# Altium project OT.PrjPcb (part 1 of 2)
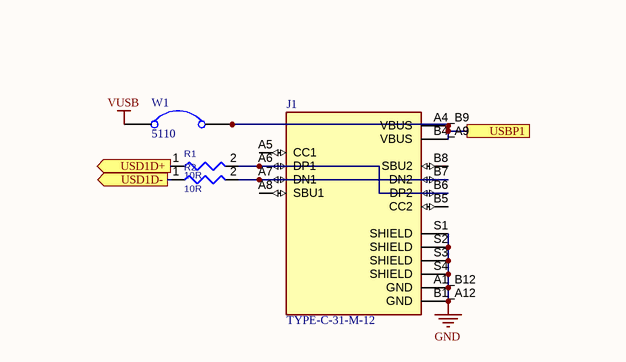
[diagram p0: Sheet_1.SchDoc, top left]
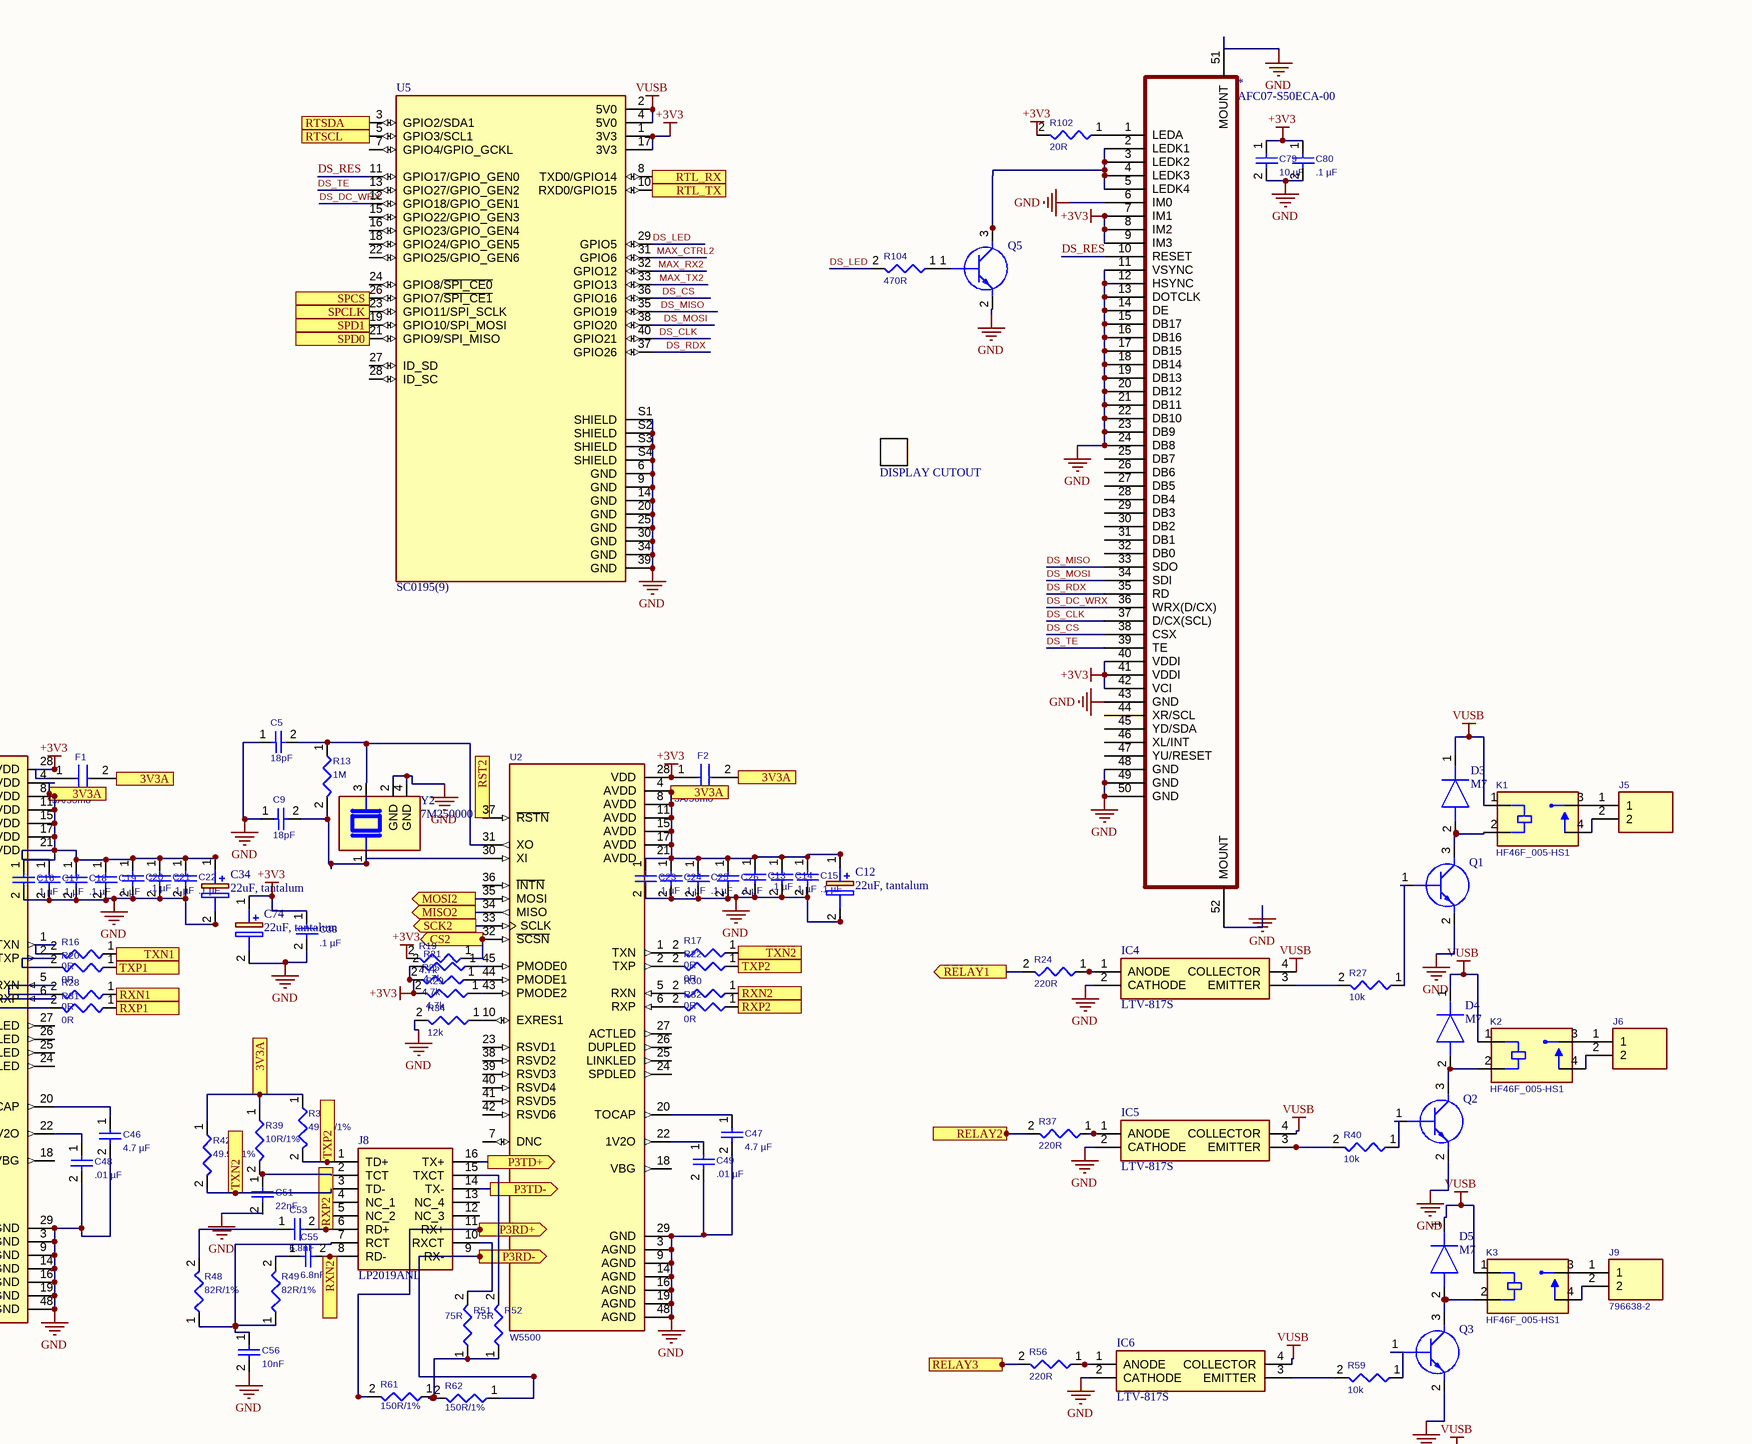
[diagram p1: Sheet_1.SchDoc, top right]
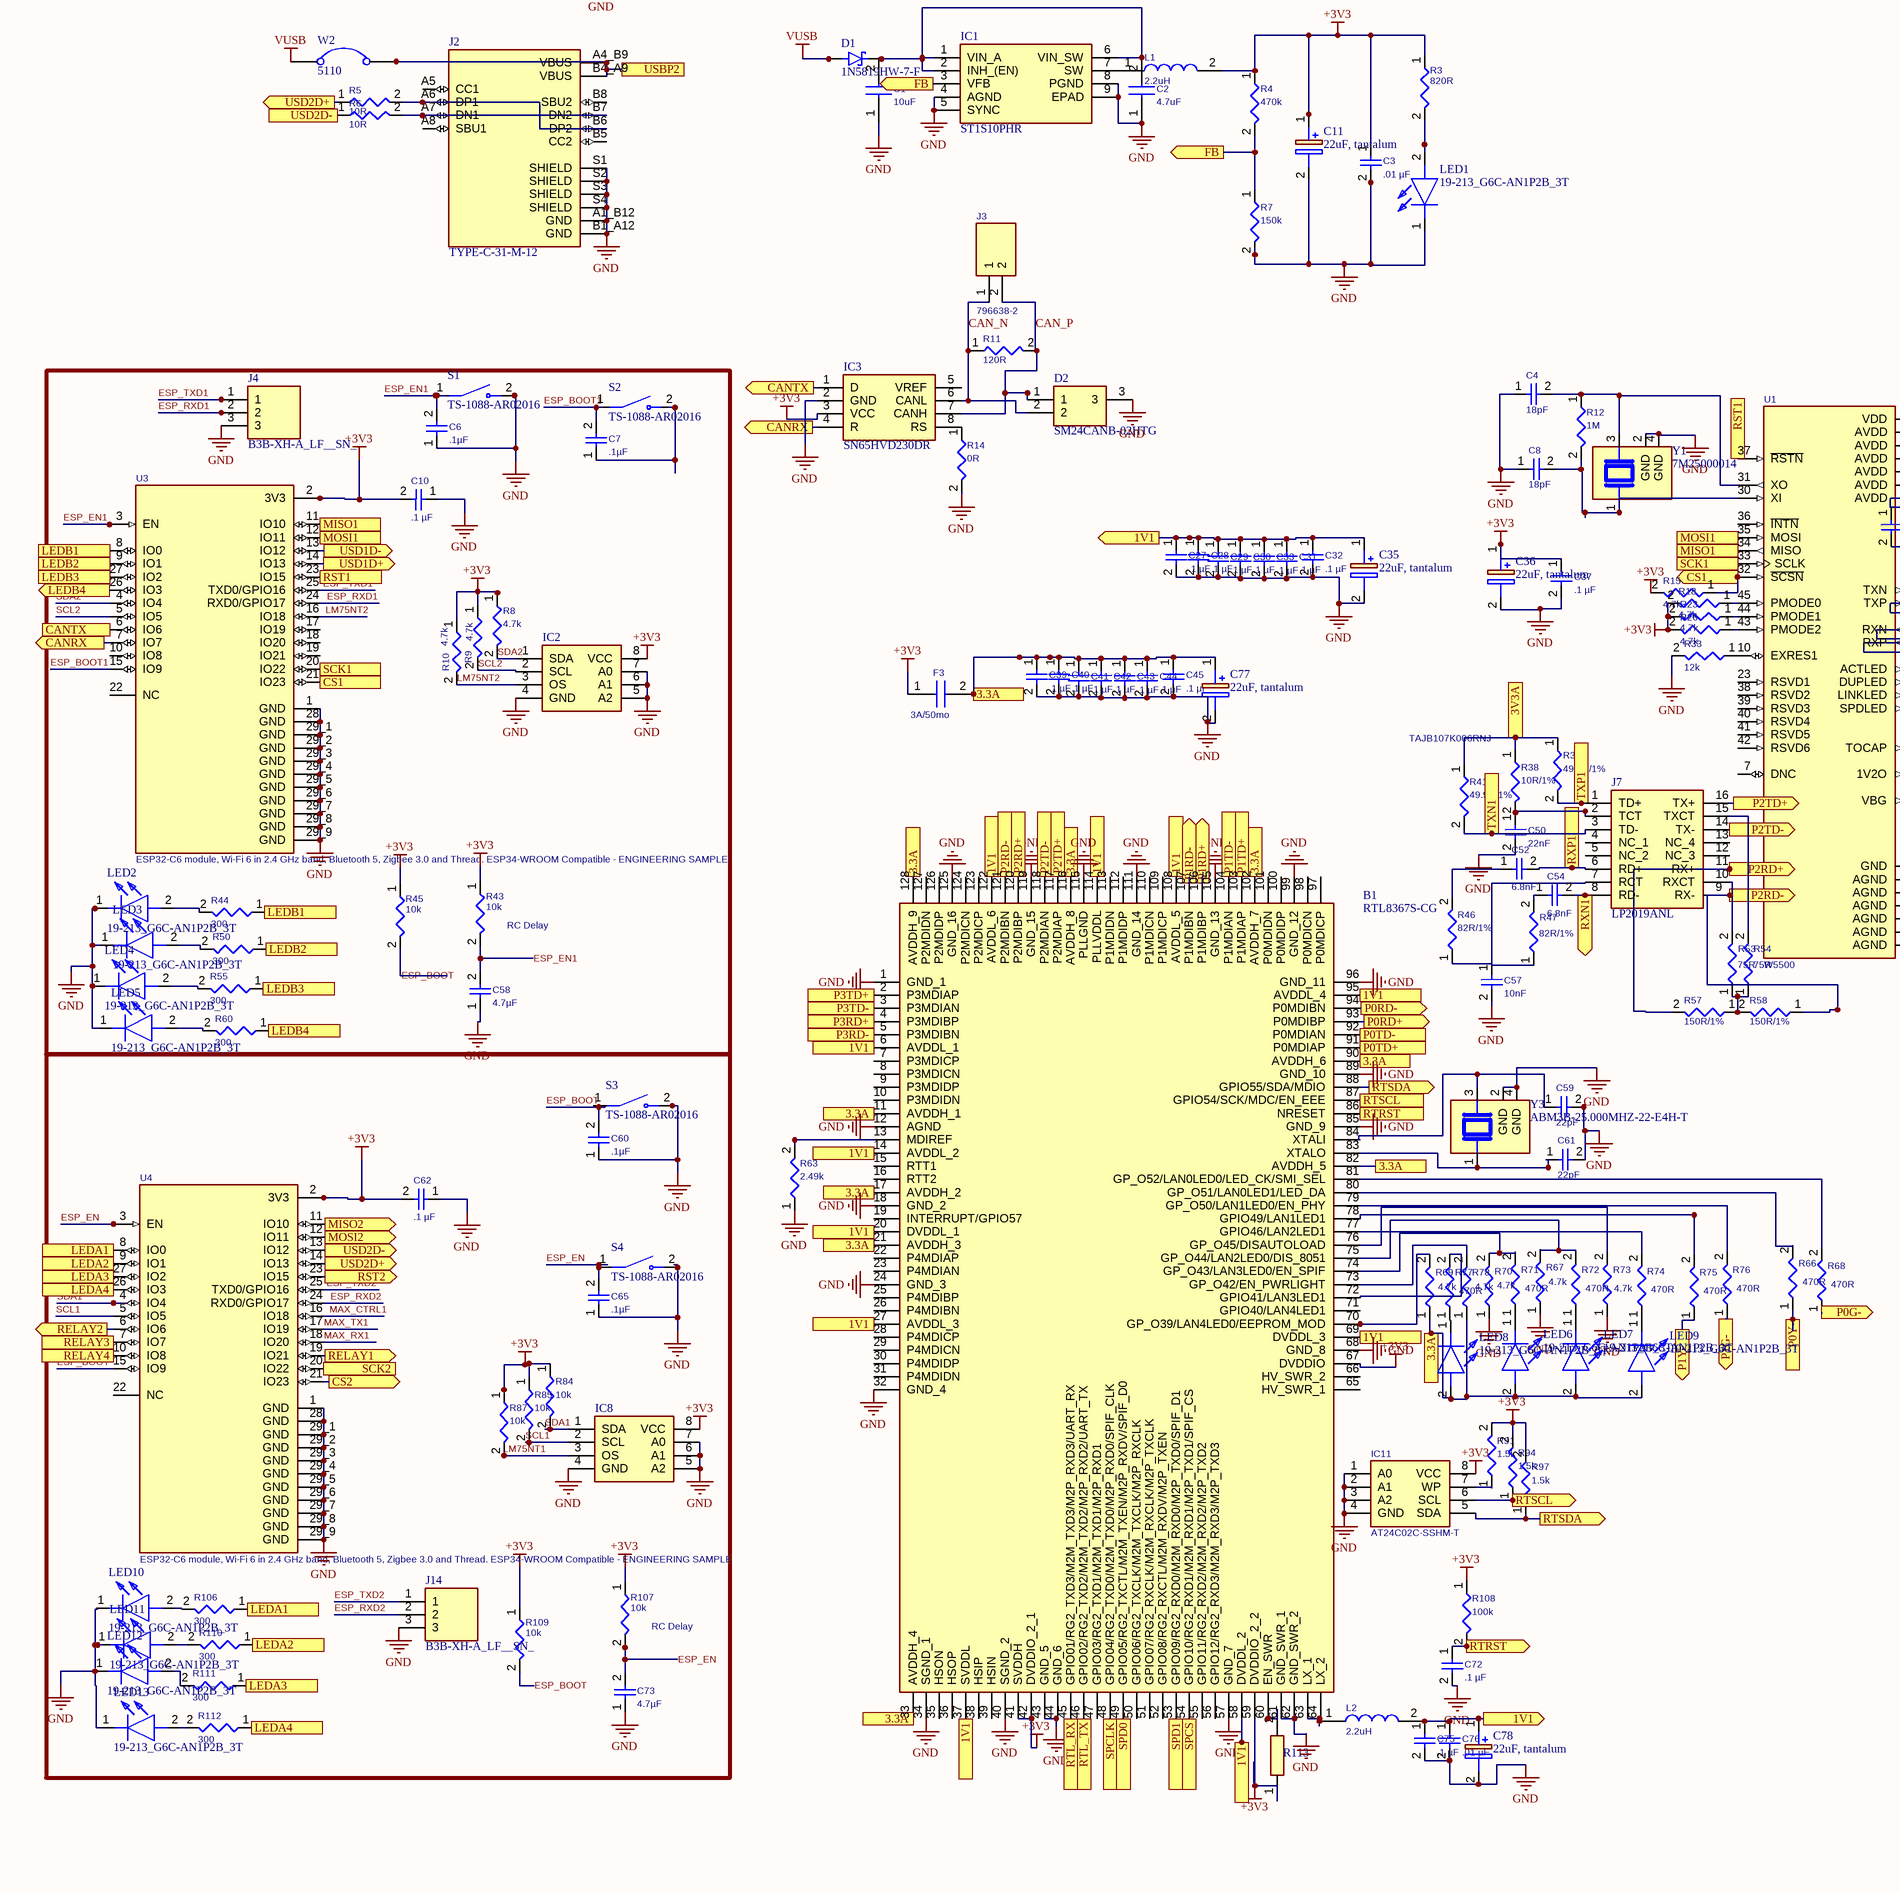
[diagram p2: Sheet_1.SchDoc, bottom left]
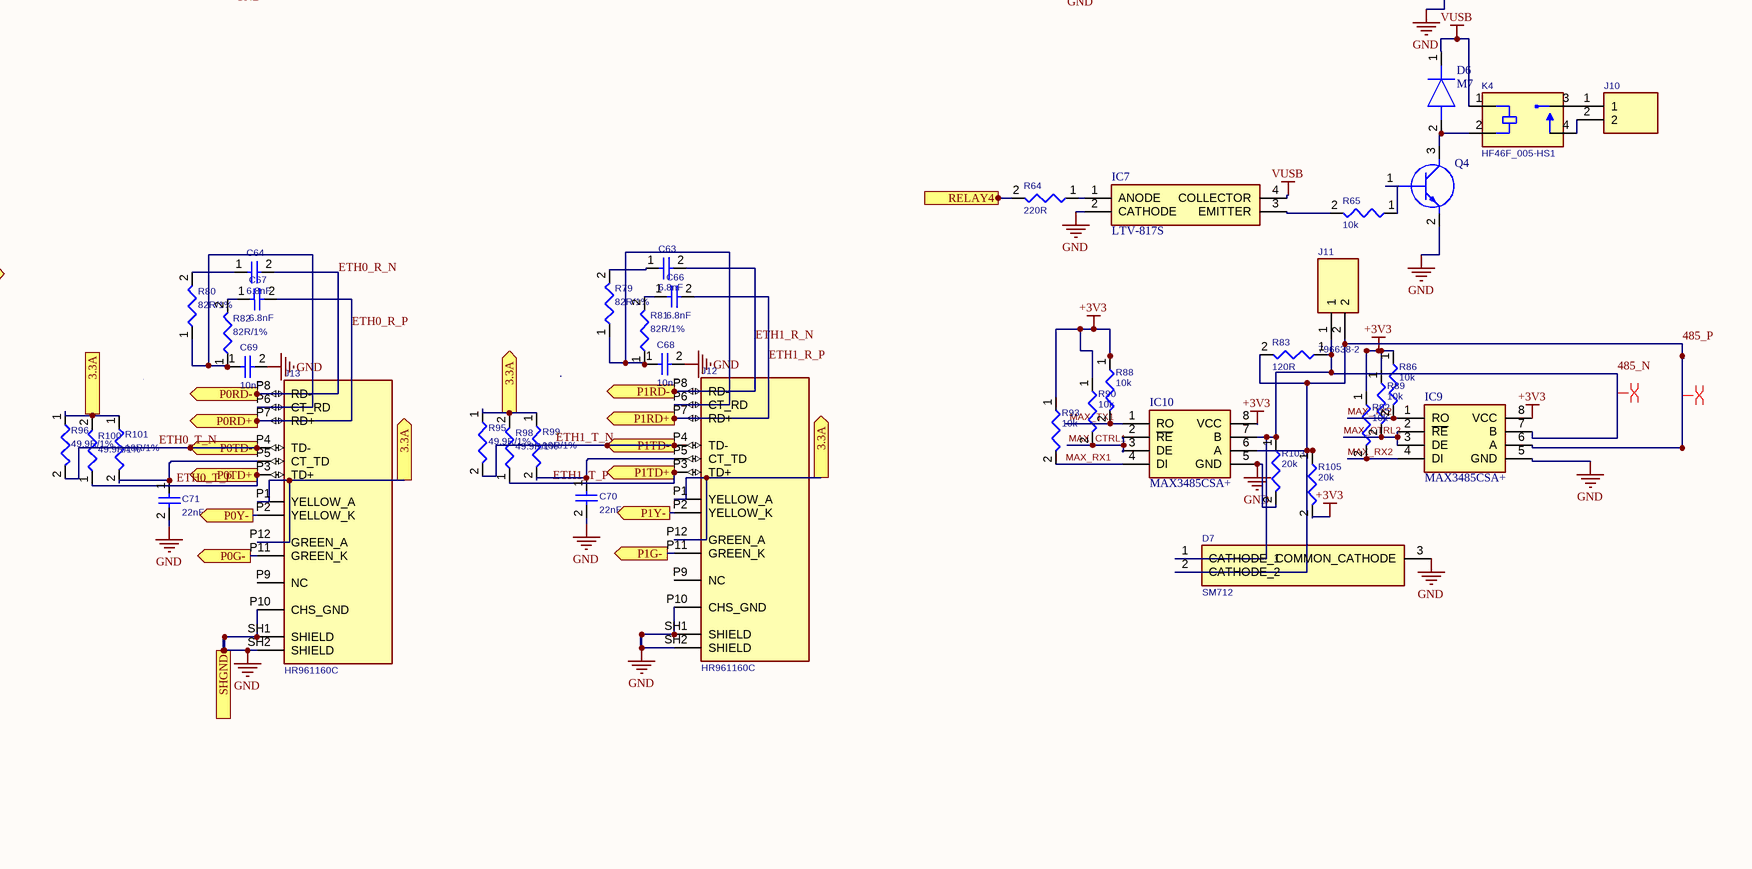
[diagram p3: Sheet_1.SchDoc, bottom right]
1 sheet, 269 parts. Net scope: flat (ports and power ports of the same name join across sheets).
Board file: OTPCB.PcbDoc

## Sheet Sheet_1.SchDoc
size 711 x 406 mm; SheetNumber: 1; SheetTotal: 1

### Parts
*  AFC07-S50ECA-00  [AFC07-S50ECA-00]
B1  RTL8367S-CG  [QFP40P1600X1600X160-128N]
C1  10uF  [CAPC1608X90N]
C2  4.7uF  [CAPC1608X90N]
C3  value .01 µF  [CAPC1608X90N]  (hidden comment: Capacitor .1µF +/-20% 10V 0603)
C4  value 18pF  [CAPC1608X90N]  (hidden comment: Capacitor 18pF +/-20% 10V 0603)
C5  value 18pF  [CAPC1608X90N]  (hidden comment: Capacitor 18pF +/-20% 10V 0603)
C6  value .1µF  [CAPC1608X90N]  (hidden comment: Capacitor .1µF +/-20% 10V 0603)
C7  value .1µF  [CAPC1608X90N]  (hidden comment: Capacitor .1µF +/-20% 10V 0603)
C8  value 18pF  [CAPC1608X90N]  (hidden comment: Capacitor 18pF +/-20% 10V 0603)
C9  value 18pF  [CAPC1608X90N]  (hidden comment: Capacitor 18pF +/-20% 10V 0603)
C10  value .1 µF  [CAPC1608X90N]  (hidden comment: Capacitor .1µF +/-20% 10V 0603)
C11  22uF, tantalum  [CAPPM3528X210N]
C12  22uF, tantalum  [CAPPM3528X210N]
C13  value .1 µF  [CAPC1608X90N]  (hidden comment: Capacitor .1µF +/-20% 10V 0603)
C14  value .1 µF  [CAPC1608X90N]  (hidden comment: Capacitor .1µF +/-20% 10V 0603)
C15  value .1 µF  [CAPC1608X90N]  (hidden comment: Capacitor .1µF +/-20% 10V 0603)
C16  value .1 µF  [CAPC1608X90N]  (hidden comment: Capacitor .1µF +/-20% 10V 0603)
C17  value .1 µF  [CAPC1608X90N]  (hidden comment: Capacitor .1µF +/-20% 10V 0603)
C18  value .1 µF  [CAPC1608X90N]  (hidden comment: Capacitor .1µF +/-20% 10V 0603)
C19  value .1 µF  [CAPC1608X90N]  (hidden comment: Capacitor .1µF +/-20% 10V 0603)
C20  value .1 µF  [CAPC1608X90N]  (hidden comment: Capacitor .1µF +/-20% 10V 0603)
C21  value .1 µF  [CAPC1608X90N]  (hidden comment: Capacitor .1µF +/-20% 10V 0603)
C22  value .1 µF  [CAPC1608X90N]  (hidden comment: Capacitor .1µF +/-20% 10V 0603)
C23  value .1 µF  [CAPC1608X90N]  (hidden comment: Capacitor .1µF +/-20% 10V 0603)
C24  value .1 µF  [CAPC1608X90N]  (hidden comment: Capacitor .1µF +/-20% 10V 0603)
C25  value .1 µF  [CAPC1608X90N]  (hidden comment: Capacitor .1µF +/-20% 10V 0603)
C26  value .1 µF  [CAPC1608X90N]  (hidden comment: Capacitor .1µF +/-20% 10V 0603)
C27  value .1 µF  [CAPC1608X90N]  (hidden comment: Capacitor .1µF +/-20% 10V 0603)
C28  value .1 µF  [CAPC1608X90N]  (hidden comment: Capacitor .1µF +/-20% 10V 0603)
C29  value .1 µF  [CAPC1608X90N]  (hidden comment: Capacitor .1µF +/-20% 10V 0603)
C30  value .1 µF  [CAPC1608X90N]  (hidden comment: Capacitor .1µF +/-20% 10V 0603)
C31  value .1 µF  [CAPC1608X90N]  (hidden comment: Capacitor .1µF +/-20% 10V 0603)
C32  value .1 µF  [CAPC1608X90N]  (hidden comment: Capacitor .1µF +/-20% 10V 0603)
C33  value .1 µF  [CAPC1608X90N]  (hidden comment: Capacitor .1µF +/-20% 10V 0603)
C34  22uF, tantalum  [CAPPM3528X210N]
C35  22uF, tantalum  [CAPPM3528X210N]
C36  22uF, tantalum  [CAPPM3528X210N]
C37  value .1 µF  [CAPC1608X90N]  (hidden comment: Capacitor .1µF +/-20% 10V 0603)
C38  value .1 µF  [CAPC1608X90N]  (hidden comment: Capacitor .1µF +/-20% 10V 0603)
C39  value .1 µF  [CAPC1608X90N]  (hidden comment: Capacitor .1µF +/-20% 10V 0603)
C40  value .1 µF  [CAPC1608X90N]  (hidden comment: Capacitor .1µF +/-20% 10V 0603)
C41  value .1 µF  [CAPC1608X90N]  (hidden comment: Capacitor .1µF +/-20% 10V 0603)
C42  value .1 µF  [CAPC1608X90N]  (hidden comment: Capacitor .1µF +/-20% 10V 0603)
C43  value .1 µF  [CAPC1608X90N]  (hidden comment: Capacitor .1µF +/-20% 10V 0603)
C44  value .1 µF  [CAPC1608X90N]  (hidden comment: Capacitor .1µF +/-20% 10V 0603)
C45  value .1 µF  [CAPC1608X90N]  (hidden comment: Capacitor .1µF +/-20% 10V 0603)
C46  value 4.7 µF  [CAPC1608X90N]  (hidden comment: Capacitor 4.7µF +/-20% 10V 0603)
C47  value 4.7 µF  [CAPC1608X90N]  (hidden comment: Capacitor 4.7µF +/-20% 10V 0603)
C48  value .01 µF  [CAPC1608X90N]  (hidden comment: Capacitor .1µF +/-20% 10V 0603)
C49  value .01 µF  [CAPC1608X90N]  (hidden comment: Capacitor .1µF +/-20% 10V 0603)
C50  value 22nF  [CAPC1608X90N]  (hidden comment: Capacitor 22nF +/-20% 10V 0603)
C51  value 22nF  [CAPC1608X90N]  (hidden comment: Capacitor 22nF +/-20% 10V 0603)
C52  value 6.8nF  [CAPC1608X90N]  (hidden comment: Capacitor 6.8nF +/-20% 10V 0603)
C53  value 6.8nF  [CAPC1608X90N]  (hidden comment: Capacitor 6.8nF +/-20% 10V 0603)
C54  value 6.8nF  [CAPC1608X90N]  (hidden comment: Capacitor 6.8nF +/-20% 10V 0603)
C55  value 6.8nF  [CAPC1608X90N]  (hidden comment: Capacitor 6.8nF +/-20% 10V 0603)
C56  value 10nF  [CAPC1608X90N]  (hidden comment: Capacitor .1µF +/-20% 10V 0603)
C57  value 10nF  [CAPC1608X90N]  (hidden comment: Capacitor .1µF +/-20% 10V 0603)
C58  value 4.7µF  [CAPC1608X90N]  (hidden comment: Capacitor 4.7µF +/-20% 10V 0603)
C59  value 22pF  [CAPC1608X90N]  (hidden comment: Capacitor 22pF +/-20% 10V 0603)
C60  value .1µF  [CAPC1608X90N]  (hidden comment: Capacitor .1µF +/-20% 10V 0603)
C61  value 22pF  [CAPC1608X90N]  (hidden comment: Capacitor 22pF +/-20% 10V 0603)
C62  value .1 µF  [CAPC1608X90N]  (hidden comment: Capacitor .1µF +/-20% 10V 0603)
C63  value 6.8nF  [CAPC1608X90N]  (hidden comment: Capacitor 6.8nF +/-20% 10V 0603)
C64  value 6.8nF  [CAPC1608X90N]  (hidden comment: Capacitor 6.8nF +/-20% 10V 0603)
C65  value .1µF  [CAPC1608X90N]  (hidden comment: Capacitor .1µF +/-20% 10V 0603)
C66  value 6.8nF  [CAPC1608X90N]  (hidden comment: Capacitor 6.8nF +/-20% 10V 0603)
C67  value 6.8nF  [CAPC1608X90N]  (hidden comment: Capacitor 6.8nF +/-20% 10V 0603)
C68  value 10nF  [CAPC1608X90N]  (hidden comment: Capacitor .1µF +/-20% 10V 0603)
C69  value 10nF  [CAPC1608X90N]  (hidden comment: Capacitor .1µF +/-20% 10V 0603)
C70  value 22nF  [CAPC1608X90N]  (hidden comment: Capacitor 22nF +/-20% 10V 0603)
C71  value 22nF  [CAPC1608X90N]  (hidden comment: Capacitor 22nF +/-20% 10V 0603)
C72  value .1 µF  [CAPC1608X90N]  (hidden comment: Capacitor .1µF +/-20% 10V 0603)
C73  value 4.7µF  [CAPC1608X90N]  (hidden comment: Capacitor 4.7µF +/-20% 10V 0603)
C74  22uF, tantalum  [CAPPM3528X210N]
C75  value .1 µF  [CAPC1608X90N]  (hidden comment: Capacitor .1µF +/-20% 10V 0603)
C76  value .01 µF  [CAPC1608X90N]  (hidden comment: Capacitor .1µF +/-20% 10V 0603)
C77  22uF, tantalum  [CAPPM3528X210N]
C78  22uF, tantalum  [CAPPM3528X210N]
C79  value 10 µF  [CAPC1608X90N]  (hidden comment: Capacitor 10µF +/-20% 10V 0603)
C80  value .1 µF  [CAPC1608X90N]  (hidden comment: Capacitor .1µF +/-20% 10V 0603)
CUTOUT1  DISPLAY CUTOUT  [display]
D1  1N5819HW-7-F  [SOD3715X145N]
D2  SM24CANB-02HTG  [SM24CANB02HTG]
D3  M7  [DIOM5626X245N]
D4  M7  [DIOM5626X245N]
D5  M7  [DIOM5626X245N]
D6  M7  [DIOM5626X245N]
D7  SM712  [SOT95P240X115-3N]
F1  3A/50mo  [CAPC1608X90N]
F2  3A/50mo  [CAPC1608X90N]
F3  3A/50mo  [CAPC1608X90N]
IC1  ST1S10PHR  [ST1S10PHR]
IC2  (no value)  [SOIC127P600X175-8N]
IC3  SN65HVD230DR  [SOIC127P600X175-8N]
IC4  LTV-817S  [SOP254P1016X460-4N]
IC5  LTV-817S  [SOP254P1016X460-4N]
IC6  LTV-817S  [SOP254P1016X460-4N]
IC7  LTV-817S  [SOP254P1016X460-4N]
IC8  (no value)  [SOIC127P600X175-8N]
IC9  MAX3485CSA+  [SOIC127P600X175-8N]
IC10  MAX3485CSA+  [SOIC127P600X175-8N]
IC11  AT24C02C-SSHM-T  [SOIC127P600X175-8N]
J1  TYPE-C-31-M-12  [HRO_TYPE-C-31-M-12]
J2  TYPE-C-31-M-12  [HRO_TYPE-C-31-M-12]
J3  796638-2  [SHDRRA2W102P0X508_1X2_1198X1200X850P]
J4  B3B-XH-A_LF__SN_  [B3BXHALFSN]
J5  (no value)  [SHDRRA2W102P0X508_1X2_1198X1200X850P]
J6  (no value)  [SHDRRA2W102P0X508_1X2_1198X1200X850P]
J7  LP2019ANL  [LP2019ANL]
J8  LP2019ANL  [LP2019ANL]
J9  796638-2  [SHDRRA2W102P0X508_1X2_1198X1200X850P]
J10  (no value)  [SHDRRA2W102P0X508_1X2_1198X1200X850P]
J11  796638-2  [SHDRRA2W102P0X508_1X2_1198X1200X850P]
J12  HR961160C  [HANRUN_HR961160C]
J13  HR961160C  [HANRUN_HR961160C]
J14  B3B-XH-A_LF__SN_  [B3BXHALFSN]
K1  HF46F_005-HS1  [RELAY_HF46F_005-HS1]
K2  HF46F_005-HS1  [RELAY_HF46F_005-HS1]
K3  HF46F_005-HS1  [RELAY_HF46F_005-HS1]
K4  HF46F_005-HS1  [RELAY_HF46F_005-HS1]
L1  2.2uH  [IND_IHLP1212BZER2R2M11]
L2  2.2uH  [IND_IHLP1212BZER2R2M11]
LED1  19-213_G6C-AN1P2B_3T  [19213G6CAN1P2B3T]
LED2  19-213_G6C-AN1P2B_3T  [19213G6CAN1P2B3T]
LED3  19-213_G6C-AN1P2B_3T  [19213G6CAN1P2B3T]
LED4  19-213_G6C-AN1P2B_3T  [19213G6CAN1P2B3T]
LED5  19-213_G6C-AN1P2B_3T  [19213G6CAN1P2B3T]
LED6  19-213_G6C-AN1P2B_3T  [19213G6CAN1P2B3T]
LED7  19-213_G6C-AN1P2B_3T  [19213G6CAN1P2B3T]
LED8  19-213_G6C-AN1P2B_3T  [19213G6CAN1P2B3T]
LED9  19-213_G6C-AN1P2B_3T  [19213G6CAN1P2B3T]
LED10  19-213_G6C-AN1P2B_3T  [19213G6CAN1P2B3T]
LED11  19-213_G6C-AN1P2B_3T  [19213G6CAN1P2B3T]
LED12  19-213_G6C-AN1P2B_3T  [19213G6CAN1P2B3T]
LED13  19-213_G6C-AN1P2B_3T  [19213G6CAN1P2B3T]
Q1  MMBT2222A-G  [SOT95P240X115-3N]  (value not drawn)
Q2  MMBT2222A-G  [SOT95P240X115-3N]  (value not drawn)
Q3  MMBT2222A-G  [SOT95P240X115-3N]  (value not drawn)
Q4  MMBT2222A-G  [SOT95P240X115-3N]  (value not drawn)
Q5  MMBT2222A-G  [SOT95P240X115-3N]  (value not drawn)
R1  value 10R  [CAPC1608X90N]  (hidden comment: Resistor 10 +/-1% 0603 100 mW)
R2  value 10R  [CAPC1608X90N]  (hidden comment: Resistor 10 +/-1% 0603 100 mW)
R3  value 820R  [RESC1608X55X25ML10T15]  (hidden comment: Resistor 820 +/-1% 0603 100 mW)
R4  value 470k  [RESC1608X55X25ML10T15]  (hidden comment: Resistor 270k +/-1% 0603 100 mW)
R5  value 10R  [CAPC1608X90N]  (hidden comment: Resistor 10 +/-1% 0603 100 mW)
R6  value 10R  [CAPC1608X90N]  (hidden comment: Resistor 10 +/-1% 0603 100 mW)
R7  value 150k  [RESC1608X55X25ML10T15]  (hidden comment: Resistor 86k +/-1% 0603 100 mW)
R8  value 4.7k  [RESC1608X55X25ML10T15]  (hidden comment: Resistor 4.7k +/-1% 0603 100 mW)
R9  value 4.7k  [RESC1608X55X25ML10T15]  (hidden comment: Resistor 4.7k +/-1% 0603 100 mW)
R10  value 4.7k  [RESC1608X55X25ML10T15]  (hidden comment: Resistor 4.7k +/-1% 0603 100 mW)
R11  value 120R  [RESC1608X55X25ML10T15]  (hidden comment: Resistor 120 +/-1% 0603 100 mW)
R12  value 1M  [RESC1608X55X25ML10T15]  (hidden comment: Resistor 1M +/-1% 0603 100 mW)
R13  value 1M  [RESC1608X55X25ML10T15]  (hidden comment: Resistor 1M +/-1% 0603 100 mW)
R14  value 0R  [RESC1608X55X25ML10T15]  (hidden comment: Resistor 0R +/-1% 0603 100 mW)
R15  value 4.7k  [RESC1608X55X25ML10T15]  (hidden comment: Resistor 4.7k +/-1% 0603 100 mW)
R16  value 0R  [RESC1608X55X25ML10T15]  (hidden comment: Resistor 0R +/-1% 0603 100 mW)
R17  value 0R  [RESC1608X55X25ML10T15]  (hidden comment: Resistor 0R +/-1% 0603 100 mW)
R18  value 4.7k  [RESC1608X55X25ML10T15]  (hidden comment: Resistor 4.7k +/-1% 0603 100 mW)
R19  value 4.7k  [RESC1608X55X25ML10T15]  (hidden comment: Resistor 4.7k +/-1% 0603 100 mW)
R20  value 0R  [RESC1608X55X25ML10T15]  (hidden comment: Resistor 0R +/-1% 0603 100 mW)
R21  value 4.7k  [RESC1608X55X25ML10T15]  (hidden comment: Resistor 4.7k +/-1% 0603 100 mW)
R22  value 0R  [RESC1608X55X25ML10T15]  (hidden comment: Resistor 0R +/-1% 0603 100 mW)
R23  value 4.7k  [RESC1608X55X25ML10T15]  (hidden comment: Resistor 4.7k +/-1% 0603 100 mW)
R24  value 220R  [RESC1608X55X25ML10T15]  (hidden comment: Resistor 220 +/-1% 0603 100 mW)
R25  value 4.7k  [RESC1608X55X25ML10T15]  (hidden comment: Resistor 4.7k +/-1% 0603 100 mW)
R26  value 4.7k  [RESC1608X55X25ML10T15]  (hidden comment: Resistor 4.7k +/-1% 0603 100 mW)
R27  value 10k  [RESC1608X55X25ML10T15]  (hidden comment: Resistor 10k +/-1% 0603 100 mW)
R28  value 0R  [RESC1608X55X25ML10T15]  (hidden comment: Resistor 0R +/-1% 0603 100 mW)
R29  value 4.7k  [RESC1608X55X25ML10T15]  (hidden comment: Resistor 4.7k +/-1% 0603 100 mW)
R30  value 0R  [RESC1608X55X25ML10T15]  (hidden comment: Resistor 0R +/-1% 0603 100 mW)
R31  value 0R  [RESC1608X55X25ML10T15]  (hidden comment: Resistor 0R +/-1% 0603 100 mW)
R32  value 0R  [RESC1608X55X25ML10T15]  (hidden comment: Resistor 0R +/-1% 0603 100 mW)
R33  value 12k  [RESC1608X55X25ML10T15]  (hidden comment: Resistor 12k +/-1% 0603 100 mW)
R34  value 12k  [RESC1608X55X25ML10T15]  (hidden comment: Resistor 12k +/-1% 0603 100 mW)
R35  value 49.9R/1%  [RESC1608X55X25ML10T15]  (hidden comment: Resistor 49.9+/-1% 0603 100 mW)
R36  value 49.9R/1%  [RESC1608X55X25ML10T15]  (hidden comment: Resistor 49.9+/-1% 0603 100 mW)
R37  value 220R  [RESC1608X55X25ML10T15]  (hidden comment: Resistor 220 +/-1% 0603 100 mW)
R38  value 10R/1%  [RESC1608X55X25ML10T15]  (hidden comment: Resistor 10 +/-1% 0603 100 mW)
R39  value 10R/1%  [RESC1608X55X25ML10T15]  (hidden comment: Resistor 10 +/-1% 0603 100 mW)
R40  value 10k  [RESC1608X55X25ML10T15]  (hidden comment: Resistor 10k +/-1% 0603 100 mW)
R41  value 49.9R/1%  [RESC1608X55X25ML10T15]  (hidden comment: Resistor 49.9+/-1% 0603 100 mW)
R42  value 49.9R/1%  [RESC1608X55X25ML10T15]  (hidden comment: Resistor 49.9+/-1% 0603 100 mW)
R43  value 10k  [RESC1608X55X25ML10T15]  (hidden comment: Resistor 10k +/-1% 0603 100 mW)
R44  value 300  [CAPC1608X90N]  (hidden comment: Resistor 300 +/-1% 0603 100 mW)
R45  value 10k  [RESC1608X55X25ML10T15]  (hidden comment: Resistor 10k +/-1% 0603 100 mW)
R46  value 82R/1%  [RESC1608X55X25ML10T15]  (hidden comment: Resistor 82 +/-1% 0603 100 mW)
R47  value 82R/1%  [RESC1608X55X25ML10T15]  (hidden comment: Resistor 82 +/-1% 0603 100 mW)
R48  value 82R/1%  [RESC1608X55X25ML10T15]  (hidden comment: Resistor 82 +/-1% 0603 100 mW)
R49  value 82R/1%  [RESC1608X55X25ML10T15]  (hidden comment: Resistor 82 +/-1% 0603 100 mW)
R50  value 300  [CAPC1608X90N]  (hidden comment: Resistor 300 +/-1% 0603 100 mW)
R51  value 75R  [RESC1608X55X25ML10T15]  (hidden comment: Resistor 75 +/-1% 0603 100 mW)
R52  value 75R  [RESC1608X55X25ML10T15]  (hidden comment: Resistor 75 +/-1% 0603 100 mW)
R53  value 75R  [RESC1608X55X25ML10T15]  (hidden comment: Resistor 75 +/-1% 0603 100 mW)
R54  value 75R  [RESC1608X55X25ML10T15]  (hidden comment: Resistor 75 +/-1% 0603 100 mW)
R55  value 300  [CAPC1608X90N]  (hidden comment: Resistor 300 +/-1% 0603 100 mW)
R56  value 220R  [RESC1608X55X25ML10T15]  (hidden comment: Resistor 220 +/-1% 0603 100 mW)
R57  value 150R/1%  [RESC1608X55X25ML10T15]  (hidden comment: Resistor 150 +/-1% 0603 100 mW)
R58  value 150R/1%  [RESC1608X55X25ML10T15]  (hidden comment: Resistor 150 +/-1% 0603 100 mW)
R59  value 10k  [RESC1608X55X25ML10T15]  (hidden comment: Resistor 10k +/-1% 0603 100 mW)
R60  value 300  [CAPC1608X90N]  (hidden comment: Resistor 300 +/-1% 0603 100 mW)
R61  value 150R/1%  [RESC1608X55X25ML10T15]  (hidden comment: Resistor 150 +/-1% 0603 100 mW)
R62  value 150R/1%  [RESC1608X55X25ML10T15]  (hidden comment: Resistor 150 +/-1% 0603 100 mW)
R63  value 2.49k  [CAPC1608X90N]  (hidden comment: Resistor 300 +/-1% 0603 100 mW)
R64  value 220R  [RESC1608X55X25ML10T15]  (hidden comment: Resistor 220 +/-1% 0603 100 mW)
R65  value 10k  [RESC1608X55X25ML10T15]  (hidden comment: Resistor 10k +/-1% 0603 100 mW)
R66  value 470R  [RESC1608X55X25ML10T15]  (hidden comment: Resistor 470 +/-1% 0603 100 mW)
R67  value 4.7k  [RESC1608X55X25ML10T15]  (hidden comment: Resistor 4.7k +/-1% 0603 100 mW)
R68  value 470R  [RESC1608X55X25ML10T15]  (hidden comment: Resistor 470 +/-1% 0603 100 mW)
R69  value 4.7k  [RESC1608X55X25ML10T15]  (hidden comment: Resistor 4.7k +/-1% 0603 100 mW)
R70  value 4.7k  [RESC1608X55X25ML10T15]  (hidden comment: Resistor 4.7k +/-1% 0603 100 mW)
R71  value 470R  [RESC1608X55X25ML10T15]  (hidden comment: Resistor 470 +/-1% 0603 100 mW)
R72  value 470R  [RESC1608X55X25ML10T15]  (hidden comment: Resistor 470 +/-1% 0603 100 mW)
R73  value 4.7k  [RESC1608X55X25ML10T15]  (hidden comment: Resistor 4.7k +/-1% 0603 100 mW)
R74  value 470R  [RESC1608X55X25ML10T15]  (hidden comment: Resistor 470 +/-1% 0603 100 mW)
R75  value 470R  [RESC1608X55X25ML10T15]  (hidden comment: Resistor 470 +/-1% 0603 100 mW)
R76  value 470R  [RESC1608X55X25ML10T15]  (hidden comment: Resistor 470 +/-1% 0603 100 mW)
R77  value 470R  [RESC1608X55X25ML10T15]  (hidden comment: Resistor 470 +/-1% 0603 100 mW)
R78  value 4.7k  [RESC1608X55X25ML10T15]  (hidden comment: Resistor 4.7k +/-1% 0603 100 mW)
R79  value 82R/1%  [RESC1608X55X25ML10T15]  (hidden comment: Resistor 82 +/-1% 0603 100 mW)
R80  value 82R/1%  [RESC1608X55X25ML10T15]  (hidden comment: Resistor 82 +/-1% 0603 100 mW)
R81  value 82R/1%  [RESC1608X55X25ML10T15]  (hidden comment: Resistor 82 +/-1% 0603 100 mW)
R82  value 82R/1%  [RESC1608X55X25ML10T15]  (hidden comment: Resistor 82 +/-1% 0603 100 mW)
R83  value 120R  [RESC1608X55X25ML10T15]  (hidden comment: jc)
R84  value 10k  [RESC1608X55X25ML10T15]  (hidden comment: Resistor 10k +/-1% 0603 100 mW)
R85  value 10k  [RESC1608X55X25ML10T15]  (hidden comment: Resistor 10k +/-1% 0603 100 mW)
R86  value 10k  [RESC1608X55X25ML10T15]  (hidden comment: Resistor 10k +/-1% 0603 100 mW)
R87  value 10k  [RESC1608X55X25ML10T15]  (hidden comment: Resistor 10k +/-1% 0603 100 mW)
R88  value 10k  [RESC1608X55X25ML10T15]  (hidden comment: Resistor 10k +/-1% 0603 100 mW)
R89  value 10k  [RESC1608X55X25ML10T15]  (hidden comment: Resistor 10k +/-1% 0603 100 mW)
R90  value 10k  [RESC1608X55X25ML10T15]  (hidden comment: Resistor 10k +/-1% 0603 100 mW)
R91  value 1.5k  [CAPC1608X90N]  (hidden comment: Resistor 1.5k +/-1% 0603 100 mW)
R92  value 10k  [RESC1608X55X25ML10T15]  (hidden comment: Resistor 10k +/-1% 0603 100 mW)
R93  value 10k  [RESC1608X55X25ML10T15]  (hidden comment: Resistor 10k +/-1% 0603 100 mW)
R94  value 1.5k  [CAPC1608X90N]  (hidden comment: Resistor 1.5k +/-1% 0603 100 mW)
R95  value 49.9R/1%  [RESC1608X55X25ML10T15]  (hidden comment: Resistor 49.9+/-1% 0603 100 mW)
R96  value 49.9R/1%  [RESC1608X55X25ML10T15]  (hidden comment: Resistor 49.9+/-1% 0603 100 mW)
R97  value 1.5k  [CAPC1608X90N]  (hidden comment: Resistor 1.5k +/-1% 0603 100 mW)
R98  value 49.9R/1%  [RESC1608X55X25ML10T15]  (hidden comment: Resistor 49.9+/-1% 0603 100 mW)
R99  value 10R/1%  [RESC1608X55X25ML10T15]  (hidden comment: Resistor 10 +/-1% 0603 100 mW)
R100  value 49.9R/1%  [RESC1608X55X25ML10T15]  (hidden comment: Resistor 49.9+/-1% 0603 100 mW)
R101  value 10R/1%  [RESC1608X55X25ML10T15]  (hidden comment: Resistor 10 +/-1% 0603 100 mW)
R102  value 20R  [RESC1608X55X25ML10T15]  (hidden comment: Resistor 20 +/-1% 0603 100 mW)
R103  value 20k  [RESC1608X55X25ML10T15]  (hidden comment: Resistor 20k +/-1% 0603 100 mW)
R104  value 470R  [RESC1608X55X25ML10T15]  (hidden comment: Resistor 470 +/-1% 0603 100 mW)
R105  value 20k  [RESC1608X55X25ML10T15]  (hidden comment: Resistor 20k +/-1% 0603 100 mW)
R106  value 300  [CAPC1608X90N]  (hidden comment: Resistor 300 +/-1% 0603 100 mW)
R107  value 10k  [RESC1608X55X25ML10T15]  (hidden comment: Resistor 10k +/-1% 0603 100 mW)
R108  value 100k  [RESC1608X55X25ML10T15]  (hidden comment: Resistor 100K +/-1% 0603 100 mW)
R109  value 10k  [RESC1608X55X25ML10T15]  (hidden comment: Resistor 10k +/-1% 0603 100 mW)
R110  value 300  [CAPC1608X90N]  (hidden comment: Resistor 300 +/-1% 0603 100 mW)
R111  value 300  [CAPC1608X90N]  (hidden comment: Resistor 300 +/-1% 0603 100 mW)
R112  value 300  [CAPC1608X90N]  (hidden comment: Resistor 300 +/-1% 0603 100 mW)
R113  1K. 0603  [RESC1608X55N]  (value not drawn)
S1  TS-1088-AR02016  [SW_TS-1088-AR02016]
S2  TS-1088-AR02016  [SW_TS-1088-AR02016]
S3  TS-1088-AR02016  [SW_TS-1088-AR02016]
S4  TS-1088-AR02016  [SW_TS-1088-AR02016]
U1  W5500  [QFP50P900X900X160-48N]
U2  W5500  [QFP50P900X900X160-48N]
U3  ESP32-C6 module, Wi-Fi 6 in 2.4 GHz band, Bluetooth 5, Zigbee 3.0 and Thread. ESP34-WROOM Compatible - ENGINEERING SAMPLE  [XCVR_ESP32-C6-WROOM-1-N8]
U4  ESP32-C6 module, Wi-Fi 6 in 2.4 GHz band, Bluetooth 5, Zigbee 3.0 and Thread. ESP34-WROOM Compatible - ENGINEERING SAMPLE  [XCVR_ESP32-C6-WROOM-1-N8]
U5  SC0195(9)  [MODULE_SC0195(9)]
W1  5110  [CAPC1608X90N]
W2  5110  [CAPC1608X90N]
Y1  7M25000014  [XTAL_7M25000014]
Y2  7M25000014  [XTAL_7M25000014]
Y3  ABM3B-25.000MHZ-22-E4H-T  [XTAL_ABM3B-25.000MHZ-22-E4H-T]

### Blocks framed on the sheet
RC Delay: C6 C7 C10 C58 IC2 J4 LED2-LED5 R8-R10 R43-R45 R50 R55 R60 S1 S2 U3
RC Delay: C60 C62 C65 C73 IC8 J14 LED10-LED13 R84 R85 R87 R106 R107 R109-R112 S3 S4 U4

### Ports
1V1 (out), 3.3A, 3.3A (out), 3V3A, CANRX (out), CANTX (out), CS1 (out), CS2 (out), FB (out), LEDA1 (out), LEDA2 (out), LEDA3 (out), LEDA4 (out), LEDB1 (out), LEDB2 (out), LEDB3 (out), LEDB4 (out), MISO1 (out), MISO2 (out), MOSI1 (out), MOSI2 (out), P0G- (out), P0RD+ (out), P0RD- (out), P0TD+ (out), P0TD- (out), P0Y- (out), P1G- (out), P1RD+ (out), P1RD- (out), P1TD+ (out), P1TD- (out), P1Y- (out), P2RD+ (out), P2RD- (out), P2TD+ (out), P2TD- (out), P3RD+ (out), P3RD- (out), P3TD+ (out), P3TD- (out), RELAY1 (out), RELAY2 (out), RELAY3 (out), RELAY4 (out), RST1 (out), RST2 (out), RTL_RX (out), RTL_TX (out), RTRST (out), RTSCL (out), RTSDA (out), RXN1 (out), RXN2 (out), RXP1 (out), RXP2 (out), SCK1 (out), SCK2 (out), SHGND (out), SPCLK (out), SPCS (out), SPD0 (out), SPD1 (out), TXN1 (out), TXN2 (out), TXP1 (out), TXP2 (out), USBP1, USBP2, USD1D+ (out), USD1D- (out), USD2D+ (out), USD2D- (out)

### Nets
+3V3: *.7(IM1) *.8(IM2) *.9(IM3) *.40(VDDI) *.41(VDDI) *.42(VCI) B1.41(SVDDH) B1.42(DVDDIO_2_1) B1.59(DVDDIO_2_2) B1.67(DVDDIO) C3.1 C10.2 C11.1(+) C36.1(+) C37.1 C38.1 C62.2 C74.1(+) C79.1 C80.1 F1.1 F2.1 F3.1 IC2.8(VCC) IC3.3(VCC) IC8.8(VCC) IC9.8(VCC) IC10.8(VCC) IC11.8(VCC) L1.2 R3.1 R4.1 R8.1 R9.1 R10.1 R15.2 R18.2 R19.2 R21.2 R23.2 R25.2 R26.2 R29.2 R43.1 R45.1 R84.1 R85.1 R86.1 R87.1 R88.1 R89.1 R90.1 R91.2 R92.1 R93.1 R94.2 R97.2 R102.2 R105.2 R107.1 R108.1 R109.1 R113.1 U1.28(VDD) U2.28(VDD) U3.2(3V3) U4.2(3V3) U5.1(3V3) U5.17(3V3)
GND: *.6(IM0) *.11(VSYNC) *.12(HSYNC) *.13(DOTCLK) *.14(DE) *.15(DB17) *.16(DB16) *.17(DB15) *.18(DB14) *.19(DB13) *.20(DB12) *.21(DB11) *.22(DB10) *.23(DB9) *.24(DB8) *.43(GND) *.48(GND) *.49(GND) *.50(GND) *.51(MOUNT) *.52(MOUNT) B1.1(GND_1) B1.12(AGND) B1.18(GND_2) B1.24(GND_3) B1.32(GND_4) B1.34(SGND_1) B1.40(SGND_2) B1.43(GND_5) B1.44(GND_6) B1.57(GND_7) B1.61(GND_SWR_1) B1.62(GND_SWR_2) B1.68(GND_8) B1.85(GND_9) B1.89(GND_10) B1.96(GND_11) B1.99(GND_12) B1.105(GND_13) B1.111(GND_14) B1.115(PLLGND) B1.119(GND_15) B1.125(GND_16) C1.1 C2.1 C3.2 C4.1 C5.1 C6.1 C8.1 C9.1 C10.1 C11.2(-) C12.2(-) C13.2 C14.2 C15.2 C16.2 C17.2 C18.2 C19.2 C20.2 C21.2 C22.2 C23.2 C24.2 C25.2 C26.2 C27.2 C28.2 C29.2 C30.2 C31.2 C32.2 C33.2 C34.2(-) C35.2(-) C36.2(-) C37.2 C38.2 C39.2 C40.2 C41.2 C42.2 C43.2 C44.2 C45.2 C46.2 C47.2 C48.2 C49.2 C50.2 C51.2 C56.2 C57.2 C58.1 C59.2 C60.1 C61.2 C62.1 C65.1 C68.2 C69.2 C70.2 C71.2 C72.2 C73.1 C74.2(-) C75.2 C76.2 C77.2(-) C78.2(-) C79.2 C80.2 D2.3 D7.3(COMMON_CATHODE) IC1.4(AGND) IC1.5(SYNC) IC1.8(PGND) IC1.9(EPAD) IC2.4(GND) IC2.5(A2) IC2.6(A1) IC2.7(A0) IC3.2(GND) IC4.2(CATHODE) IC5.2(CATHODE) IC6.2(CATHODE) IC7.2(CATHODE) IC8.4(GND) IC8.5(A2) IC8.6(A1) IC8.7(A0) IC9.5(GND) IC10.5(GND) IC11.1(A0) IC11.2(A1) IC11.3(A2) IC11.4(GND) J1.A1_B12(GND) J1.B1_A12(GND) J1.S1(SHIELD) J1.S2(SHIELD) J1.S3(SHIELD) J1.S4(SHIELD) J2.A1_B12(GND) J2.B1_A12(GND) J2.S1(SHIELD) J2.S2(SHIELD) J2.S3(SHIELD) J2.S4(SHIELD) J4.3 J12.P10(CHS_GND) J12.SH1(SHIELD) J12.SH2(SHIELD) J13.P10(CHS_GND) J13.SH1(SHIELD) J13.SH2(SHIELD) J14.3 LED1.1(K) LED2.1(K) LED3.1(K) LED4.1(K) LED5.1(K) LED11.1(K) LED12.1(K) LED13.1(K) Q1.2(E) Q2.2(E) Q3.2(E) Q4.2(E) Q5.2(E) R7.2 R14.2 R33.2 R34.2 R63.1 R67.1 R70.1 R73.1 R103.2 S1.2 S3.2 S4.2 U1.3(AGND) U1.9(AGND) U1.14(AGND) U1.16(AGND) U1.19(AGND) U1.29(GND) U1.48(AGND) U2.3(AGND) U2.9(AGND) U2.14(AGND) U2.16(AGND) U2.19(AGND) U2.29(GND) U2.48(AGND) U3.1(GND) U3.28(GND) U3.29_1(GND) U3.29_2(GND) U3.29_3(GND) U3.29_4(GND) U3.29_5(GND) U3.29_6(GND) U3.29_7(GND) U3.29_8(GND) U3.29_9(GND) U4.1(GND) U4.28(GND) U4.29_1(GND) U4.29_2(GND) U4.29_3(GND) U4.29_4(GND) U4.29_5(GND) U4.29_6(GND) U4.29_7(GND) U4.29_8(GND) U4.29_9(GND) U5.6(GND) U5.9(GND) U5.14(GND) U5.20(GND) U5.25(GND) U5.30(GND) U5.34(GND) U5.39(GND) U5.S1(SHIELD) U5.S2(SHIELD) U5.S3(SHIELD) U5.S4(SHIELD) Y1.2(GND) Y1.4(GND) Y2.2(GND) Y2.4(GND) Y3.2(GND) Y3.4(GND) ; port SHGND
VUSB: D1.A D3.1(K) D4.1(K) D5.1(K) D6.1(K) IC4.4(COLLECTOR) IC5.4(COLLECTOR) IC6.4(COLLECTOR) IC7.4(COLLECTOR) K1.1(COIL1) K2.1(COIL1) K3.1(COIL1) K4.1(COIL1) U5.2(5V0) U5.4(5V0) W1.1 W2.1
485_N: D7.1(CATHODE_1) IC9.7(B) IC10.7(B) J11.1 R83.1 R103.1
485_P: D7.2(CATHODE_2) IC9.6(A) IC10.6(A) J11.2 R83.2 R105.1
CAN_N: D2.2 IC3.6(CANL) J3.1 R11.1
CAN_P: D2.1 IC3.7(CANH) J3.2 R11.2
DS_CLK: *.37(D/CX(SCL)) U5.40(GPIO21)
DS_CS: *.38(CSX) U5.36(GPIO16)
DS_DC_WRX: *.36(WRX(D/CX)) U5.12(GPIO18/GPIO_GEN1)
DS_LED: R104.2 U5.29(GPIO5)
DS_MISO: *.33(SDO) U5.35(GPIO19)
DS_MOSI: *.34(SDI) U5.38(GPIO20)
DS_RDX: *.35(RD) U5.37(GPIO26)
DS_RES: *.10(RESET) U5.11(GPIO17/GPIO_GEN0)
DS_TE: *.39(TE) U5.13(GPIO27/GPIO_GEN2)
ESP_BOOT: C60.2 R45.2 R109.2 U4.15(IO9)
ESP_BOOT1: C7.2 S2.1 U3.15(IO9)
ESP_EN: C65.2 C73.2 R107.2 S4.1 U4.3(EN)
ESP_EN1: C6.2 C58.2 R43.2 S1.1 U3.3(EN)
ESP_RXD1: J4.2 U3.24(RXD0/GPIO17)
ESP_RXD2: J14.2 U4.24(RXD0/GPIO17)
ESP_TXD1: J4.1 U3.25(TXD0/GPIO16)
ESP_TXD2: J14.1 U4.25(TXD0/GPIO16)
ETH0_R_N: B1.94(P0MDIBN) C64.2 J13.P8(RD-) ; port P0RD-
ETH0_R_P: B1.93(P0MDIBP) C67.2 J13.P7(RD+) ; port P0RD+
ETH0_T_N: B1.92(P0MDIAN) J13.P4(TD-) R96.2 ; port P0TD-
ETH0_T_P: B1.91(P0MDIAP) J13.P3(TD+) R100.1 ; port P0TD+
ETH1_R_N: B1.107(P1MDIBN) C63.2 J12.P8(RD-) ; port P1RD-
ETH1_R_P: B1.106(P1MDIBP) C66.2 J12.P7(RD+) ; port P1RD+
ETH1_T_N: B1.104(P1MDIAN) J12.P4(TD-) R95.2 ; port P1TD-
ETH1_T_P: B1.103(P1MDIAP) J12.P3(TD+) R98.1 ; port P1TD+
LM75NT1: IC8.3(OS) R87.2
LM75NT2: IC2.3(OS) R10.2 U3.16(IO18)
MAX_CTRL1: IC10.2(~{RE}) IC10.3(DE) R90.2 U4.16(IO18)
MAX_CTRL2: IC9.2(~{RE}) IC9.3(DE) R89.2 U5.31(GPIO6)
MAX_RX1: IC10.4(DI) R93.2 U4.18(IO20)
MAX_RX2: IC9.4(DI) R92.2 U5.32(GPIO12)
MAX_TX1: IC10.1(RO) R88.2 U4.17(IO19)
MAX_TX2: IC9.1(RO) R86.2 U5.33(GPIO13)
SCL1: IC8.2(SCL) R85.2 U4.5(IO5)
SCL2: IC2.2(SCL) R9.2 U3.5(IO5)
SDA1: IC8.1(SDA) R84.2 U4.4(IO4)
SDA2: IC2.1(SDA) R8.2 U3.4(IO4)
Net*_1: *.1(LEDA) R102.1
Net*_2: *.2(LEDK1) *.3(LEDK2) *.4(LEDK3) *.5(LEDK4) Q5.3(C)
NetB1_2: B1.2(P3MDIAP) J8.16(TX+) ; port P3TD+
NetB1_3: B1.3(P3MDIAN) J8.14(TX-) ; port P3TD-
NetB1_4: B1.4(P3MDIBP) J8.11(RX+) R61.2 ; port P3RD+
NetB1_5: B1.5(P3MDIBN) J8.9(RX-) R62.1 ; port P3RD-
NetB1_6: B1.6(AVDDL_1) B1.14(AVDDL_2) B1.20(DVDDL_1) B1.27(AVDDL_3) B1.37(SVDDL) B1.58(DVDDL_2) B1.69(DVDDL_3) B1.95(AVDDL_4) B1.108(AVDDL_5) B1.114(PLLVDDL) B1.122(AVDDL_6) C27.1 C28.1 C29.1 C30.1 C31.1 C32.1 C33.1 C35.1(+) C75.1 C76.1 C78.1(+) L2.2 ; port 1V1
NetB1_11: B1.11(AVDDH_1) B1.17(AVDDH_2) B1.21(AVDDH_3) B1.33(AVDDH_4) B1.82(AVDDH_5) B1.90(AVDDH_6) B1.102(AVDDH_7) B1.116(AVDDH_8) B1.128(AVDDH_9) C39.1 C40.1 C41.1 C42.1 C43.1 C44.1 C45.1 C77.1(+) F3.2 J12.P1(YELLOW_A) J12.P12(GREEN_A) J13.P1(YELLOW_A) J13.P12(GREEN_A) LED6.2(A) LED7.2(A) LED8.2(A) LED9.2(A) R69.1 R78.1 R95.1 R98.2 R99.1 ; port 3.3A
NetB1_13: B1.13(MDIREF) R63.2
NetB1_45: B1.45(GPIO01/RG2_TXD3/M2M_TXD3/M2P_RXD3/UART_RX) U5.8(TXD0/GPIO14) ; port RTL_RX
NetB1_46: B1.46(GPIO02/RG2_TXD2/M2M_TXD2/M2P_RXD2/UART_TX) U5.10(RXD0/GPIO15) ; port RTL_TX
NetB1_48: B1.48(GPIO04/RG2_TXD0/M2M_TXD0/M2P_RXD0/SPIF_CLK) U5.23(GPIO11/SPI_SCLK) ; port SPCLK
NetB1_49: B1.49(GPIO05/RG2_TXCTL/M2M_TXEN/M2P_RXDV/SPIF_D0) U5.21(GPIO9/SPI_MISO) ; port SPD0
NetB1_53: B1.53(GPIO09/RG2_RXD0/M2M_RXD0/M2P_TXD0/SPIF_D1) U5.19(GPIO10/SPI_MOSI) ; port SPD1
NetB1_54: B1.54(GPIO10/RG2_RXD1/M2M_RXD1/M2P_TXD1/SPIF_CS) U5.26(GPIO7/~{SPI_CE1}) ; port SPCS
NetB1_60: B1.60(EN_SWR) R113.2
NetB1_63: B1.63(LX_1) B1.64(LX_2) L2.1
NetB1_70: B1.70(GP_O39/LAN4LED0/EEPROM_MOD) R69.2
NetB1_72: B1.72(GPIO41/LAN3LED1) R77.2
NetB1_73: B1.73(GP_O42/EN_PWRLIGHT) R78.2
NetB1_74: B1.74(GP_O43/LAN3LED0/EN_SPIF) R70.2 R71.2
NetB1_75: B1.75(GP_O44/LAN2LED0/DIS_8051) R67.2 R72.2
NetB1_76: B1.76(GP_O45/DISAUTOLOAD) R73.2
NetB1_77: B1.77(GPIO46/LAN2LED1) R74.2
NetB1_78: B1.78(GPIO49/LAN1LED1) R75.2
NetB1_79: B1.79(GP_O50/LAN1LED0/EN_PHY) R76.2
NetB1_80: B1.80(GP_O51/LAN0LED1/LED_DA) R66.2
NetB1_81: B1.81(GP_O52/LAN0LED0/LED_CK/SMI_SEL) R68.2
NetB1_83: B1.83(XTALO) C61.1 Y3.1
NetB1_84: B1.84(XTALI) C59.1 Y3.3
NetB1_86: B1.86(NRESET) C72.1 R108.2 ; port RTRST
NetB1_87: B1.87(GPIO54/SCK/MDC/EN_EEE) IC11.6(SCL) R94.1 U5.5(GPIO3/SCL1) ; port RTSCL
NetB1_88: B1.88(GPIO55/SDA/MDIO) IC11.5(SDA) R97.1 U5.3(GPIO2/SDA1) ; port RTSDA
NetB1_117: B1.117(P2MDIAP) J7.16(TX+) ; port P2TD+
NetB1_118: B1.118(P2MDIAN) J7.14(TX-) ; port P2TD-
NetB1_120: B1.120(P2MDIBP) J7.11(RX+) R57.2 ; port P2RD+
NetB1_121: B1.121(P2MDIBN) J7.9(RX-) R58.1 ; port P2RD-
NetC1_2: C1.2 C2.2 D1.C(K) IC1.1(VIN_A) IC1.2(INH_(EN)) IC1.6(VIN_SW)
NetC4_2: C4.2 R12.1 U1.31(XO) Y1.3
NetC5_2: C5.2 R13.1 U2.31(XO) Y2.3
NetC7_1: C7.1 S2.2
NetC8_2: C8.2 R12.2 U1.30(XI) Y1.1
NetC9_2: C9.2 R13.2 U2.30(XI) Y2.1
NetC12_1: C12.1(+) C13.1 C14.1 C15.1 C16.1 C17.1 C18.1 C19.1 C20.1 C21.1 C22.1 C23.1 C24.1 C25.1 C26.1 C34.1(+) F1.2 F2.2 R35.1 R36.1 R38.1 R39.1 R41.1 R42.1 U1.4(AVDD) U1.8(AVDD) U1.11(AVDD) U1.15(AVDD) U1.17(AVDD) U1.21(AVDD) U2.4(AVDD) U2.8(AVDD) U2.11(AVDD) U2.15(AVDD) U2.17(AVDD) U2.21(AVDD) ; port 3V3A
NetC46_1: C46.1 U1.20(TOCAP)
NetC47_1: C47.1 U2.20(TOCAP)
NetC48_1: C48.1 U1.22(1V2O)
NetC49_1: C49.1 U2.22(1V2O)
NetC50_1: C50.1 J7.2(TCT) R38.2
NetC51_1: C51.1 J8.2(TCT) R39.2
NetC52_1: C52.1 R46.2
NetC52_2: C52.2 J7.6(RD+) R31.1 ; port RXP1
NetC53_1: C53.1 R48.2
NetC53_2: C53.2 J8.6(RD+) R32.1 ; port RXP2
NetC54_1: C54.1 R47.2
NetC54_2: C54.2 J7.8(RD-) R28.1 ; port RXN1
NetC55_1: C55.1 R49.2
NetC55_2: C55.2 J8.8(RD-) R30.1 ; port RXN2
NetC56_1: C56.1 J8.7(RCT) R48.1 R49.1
NetC57_1: C57.1 J7.7(RCT) R46.1 R47.1
NetC63_1: C63.1 R79.2
NetC64_1: C64.1 R80.2
NetC66_1: C66.1 R81.2
NetC67_1: C67.1 R82.2
NetC68_1: C68.1 J12.P6(CT_RD) R79.1 R81.1
NetC69_1: C69.1 J13.P6(CT_RD) R80.1 R82.1
NetC70_1: C70.1 J12.P5(CT_TD) R99.2
NetC71_1: C71.1 J13.P5(CT_TD) R101.2
NetD3_2: D3.2(A) K1.2(COIL2) Q1.3(C)
NetD4_2: D4.2(A) K2.2(COIL2) Q2.3(C)
NetD5_2: D5.2(A) K3.2(COIL2) Q3.3(C)
NetD6_2: D6.2(A) K4.2(COIL2) Q4.3(C)
NetIC1_3: IC1.3(VFB) R4.2 R7.1 ; port FB
NetIC1_7: IC1.7(SW) L1.1
NetIC3_1: IC3.1(D) U3.6(IO6) ; port CANTX
NetIC3_4: IC3.4(R) U3.7(IO7) ; port CANRX
NetIC3_8: IC3.8(RS) R14.1
NetIC4_1: IC4.1(ANODE) R24.1
NetIC4_3: IC4.3(EMITTER) R27.2
NetIC5_1: IC5.1(ANODE) R37.1
NetIC5_3: IC5.3(EMITTER) R40.2
NetIC6_1: IC6.1(ANODE) R56.1
NetIC6_3: IC6.3(EMITTER) R59.2
NetIC7_1: IC7.1(ANODE) R64.1
NetIC7_3: IC7.3(EMITTER) R65.2
NetIC11_7: IC11.7(WP) R91.1
NetJ1_A4_B9: J1.A4_B9(VBUS) J1.B4_A9(VBUS) W1.2 ; port USBP1
NetJ1_A6: J1.A6(DP1) J1.B6(DP2) R1.2
NetJ1_A7: J1.A7(DN1) J1.B7(DN2) R2.2
NetJ2_A4_B9: J2.A4_B9(VBUS) J2.B4_A9(VBUS) W2.2 ; port USBP2
NetJ2_A6: J2.A6(DP1) J2.B6(DP2) R5.2
NetJ2_A7: J2.A7(DN1) J2.B7(DN2) R6.2
NetJ5_1: J5.1 K1.3(COM)
NetJ5_2: J5.2 K1.4(NO)
NetJ6_1: J6.1 K2.3(COM)
NetJ6_2: J6.2 K2.4(NO)
NetJ7_1: J7.1(TD+) R20.1 R35.2 ; port TXP1
NetJ7_3: J7.3(TD-) R16.1 R41.2 ; port TXN1
NetJ7_10: J7.10(RXCT) R53.2
NetJ7_15: J7.15(TXCT) R54.2
NetJ8_1: J8.1(TD+) R22.1 R36.2 ; port TXP2
NetJ8_3: J8.3(TD-) R17.1 R42.2 ; port TXN2
NetJ8_10: J8.10(RXCT) R51.2
NetJ8_15: J8.15(TXCT) R52.2
NetJ9_1: J9.1 K3.3(COM)
NetJ9_2: J9.2 K3.4(NO)
NetJ10_1: J10.1 K4.3(COM)
NetJ10_2: J10.2 K4.4(NO)
NetJ12_P2: J12.P2(YELLOW_K) R75.1 ; port P1Y-
NetJ12_P11: J12.P11(GREEN_K) R76.1 ; port P1G-
NetJ13_P2: J13.P2(YELLOW_K) R66.1 ; port P0Y-
NetJ13_P11: J13.P11(GREEN_K) R68.1 ; port P0G-
NetLED1_2: LED1.2(A) R3.2
NetLED2_2: LED2.2(A) R44.2
NetLED3_2: LED3.2(A) R50.2
NetLED4_2: LED4.2(A) R55.2
NetLED5_2: LED5.2(A) R60.2
NetLED6_1: LED6.1(K) R71.1
NetLED7_1: LED7.1(K) R72.1
NetLED8_1: LED8.1(K) R77.1
NetLED9_1: LED9.1(K) R74.1
NetLED10_2: LED10.2(A) R106.2
NetLED11_2: LED11.2(A) R110.2
NetLED12_2: LED12.2(A) R111.2
NetLED13_2: LED13.2(A) R112.2
NetQ1_1: Q1.1(B) R27.1
NetQ2_1: Q2.1(B) R40.1
NetQ3_1: Q3.1(B) R59.1
NetQ4_1: Q4.1(B) R65.1
NetQ5_1: Q5.1(B) R104.1
NetR1_1: R1.1 U3.14(IO13) ; port USD1D+
NetR2_1: R2.1 U3.13(IO12) ; port USD1D-
NetR5_1: R5.1 U4.14(IO13) ; port USD2D+
NetR6_1: R6.1 U4.13(IO12) ; port USD2D-
NetR15_1: R15.1 U1.32(~{SCSN}) U3.21(IO23) ; port CS1
NetR16_2: R16.2 U1.1(TXN)
NetR17_2: R17.2 U2.1(TXN)
NetR18_1: R18.1 U1.45(PMODE0)
NetR19_1: R19.1 U2.32(~{SCSN}) U4.21(IO23) ; port CS2
NetR20_2: R20.2 U1.2(TXP)
NetR21_1: R21.1 U2.45(PMODE0)
NetR22_2: R22.2 U2.2(TXP)
NetR23_1: R23.1 U1.44(PMODE1)
NetR24_2: R24.2 U4.19(IO21) ; port RELAY1
NetR25_1: R25.1 U2.44(PMODE1)
NetR26_1: R26.1 U1.43(PMODE2)
NetR28_2: R28.2 U1.5(RXN)
NetR29_1: R29.1 U2.43(PMODE2)
NetR30_2: R30.2 U2.5(RXN)
NetR31_2: R31.2 U1.6(RXP)
NetR32_2: R32.2 U2.6(RXP)
NetR33_1: R33.1 U1.10(EXRES1)
NetR34_1: R34.1 U2.10(EXRES1)
NetR37_2: R37.2 U4.6(IO6) ; port RELAY2
NetR44_1: R44.1 U3.8(IO0) ; port LEDB1
NetR50_1: R50.1 U3.9(IO1) ; port LEDB2
NetR51_1: R51.1 R52.1 R62.2
NetR53_1: R53.1 R54.1 R57.1 R58.2
NetR55_1: R55.1 U3.27(IO2) ; port LEDB3
NetR56_2: R56.2 U4.7(IO7) ; port RELAY3
NetR60_1: R60.1 U3.26(IO3) ; port LEDB4
NetR64_2: R64.2 U4.10(IO8) ; port RELAY4
NetR96_1: R96.1 R100.2 R101.1
NetR106_1: R106.1 U4.8(IO0) ; port LEDA1
NetR110_1: R110.1 U4.9(IO1) ; port LEDA2
NetR111_1: R111.1 U4.27(IO2) ; port LEDA3
NetR112_1: R112.1 U4.26(IO3) ; port LEDA4
NetU1_33: U1.33(SCLK) U3.20(IO22) ; port SCK1
NetU1_34: U1.34(MISO) U3.11(IO10) ; port MISO1
NetU1_35: U1.35(MOSI) U3.12(IO11) ; port MOSI1
NetU1_37: U1.37(~{RSTN}) U3.23(IO15) ; port RST1
NetU2_33: U2.33(SCLK) U4.20(IO22) ; port SCK2
NetU2_34: U2.34(MISO) U4.11(IO10) ; port MISO2
NetU2_35: U2.35(MOSI) U4.12(IO11) ; port MOSI2
NetU2_37: U2.37(~{RSTN}) U4.23(IO15) ; port RST2

Not connected (* = marked no-connect by the designer): * 25(DB7) 26(DB6) 27(DB5) 28(DB4) 29(DB3) 30(DB2) 31(DB1) 32(DB0) 44(XR/SCL) 45(YD/SDA) 46(XL/INT) 47(YU/RESET); B1 7(P3MDICP) 8(P3MDICN) 9(P3MDIDP) 10(P3MDIDN) 15(RTT1) 16(RTT2) 19(INTERRUPT/GPIO57) 22(P4MDIAP) 23(P4MDIAN) 25(P4MDIBP) 26(P4MDIBN) 28(P4MDICP) 29(P4MDICN) 30(P4MDIDP) 31(P4MDIDN) 35(HSON) 36(HSOP) 38(HSIP) 39(HSIN) 47(GPIO03/RG2_TXD1/M2M_TXD1/M2P_RXD1) 50(GPIO06/RG2_TXCLK/M2M_TXCLK/M2P_RXCLK) 51(GPIO07/RG2_RXCLK/M2M_RXCLK/M2P_TXCLK) 52(GPIO08/RG2_RXCTL/M2M_RXDV/M2P_TXEN) 55(GPIO11/RG2_RXD2/M2M_RXD2/M2P_TXD2) 56(GPIO12/RG2_RXD3/M2M_RXD3/M2P_TXD3) 65(HV_SWR_1) 66(HV_SWR_2) 71(GPIO40/LAN4LED1) 97(P0MDICP) 98(P0MDICN) 100(P0MDIDP) 101(P0MDIDN) 109(P1MDICP) 110(P1MDICN) 112(P1MDIDP) 113(P1MDIDN) 123(P2MDICP) 124(P2MDICN) 126(P2MDIDP) 127(P2MDIDN); IC3 5(VREF); J1 A5(CC1) A8(SBU1) B5(CC2) B8(SBU2); J2 A5(CC1) A8(SBU1) B5(CC2) B8(SBU2); J7 4(NC_1) 5(NC_2) 12(NC_3) 13(NC_4); J8 4(NC_1) 5(NC_2) 12(NC_3) 13(NC_4); J12 P9(NC); J13 P9(NC); LED10 1(K); R61 1; S3 1; U1 7(DNC) 18(VBG) 23(RSVD1) 24(SPDLED) 25(LINKLED) 26(DUPLED) 27(ACTLED) 36(~{INTN}) 38(RSVD2) 39(RSVD3) 40(RSVD4) 41(RSVD5) 42(RSVD6); U2 7(DNC) 18(VBG) 23(RSVD1) 24(SPDLED) 25(LINKLED) 26(DUPLED) 27(ACTLED) 36(~{INTN}) 38(RSVD2) 39(RSVD3) 40(RSVD4) 41(RSVD5) 42(RSVD6); U3 10(IO8) 17(IO19) 18(IO20) 19(IO21) 22(NC); U4 22(NC); U5 7(GPIO4/GPIO_GCKL) 15(GPIO22/GPIO_GEN3) 16(GPIO23/GPIO_GEN4) 18(GPIO24/GPIO_GEN5) 22(GPIO25/GPIO_GEN6) 24(GPIO8/~{SPI_CE0}) 27(ID_SD) 28(ID_SC)

### Layout directives
differential pair: 485_N, 485_P

### Notes on the sheet
- TAJB107K006RNJ